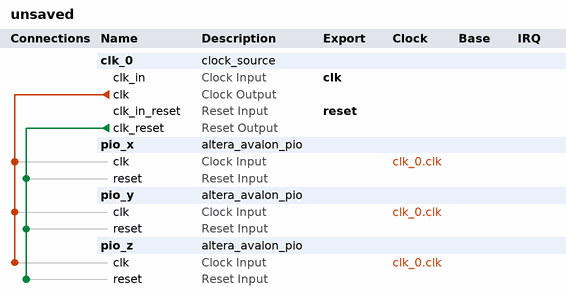
[diagram p0: system contents]
# Platform Designer (Qsys) system unsaved, Cyclone V 5CSEMA5F31C6
# Parameters at their usual value, and those the tool derives, are not listed.
package require -exact qsys 18.1
create_system unsaved
set_project_property DEVICE_FAMILY {Cyclone V}
set_project_property DEVICE 5CSEMA5F31C6

add_instance clk_0 clock_source 18.1
set_instance_parameter_value clk_0 clockFrequency 50000000

add_instance pio_x altera_avalon_pio 18.1
set_instance_parameter_value pio_x direction Input
set_instance_parameter_value pio_x width 32

add_instance pio_y altera_avalon_pio 18.1
set_instance_parameter_value pio_y direction Input
set_instance_parameter_value pio_y width 32

add_instance pio_z altera_avalon_pio 18.1
set_instance_parameter_value pio_z direction Input
set_instance_parameter_value pio_z width 32

# connections
add_connection clk_0.clk pio_x.clk clock
add_connection clk_0.clk pio_y.clk clock
add_connection clk_0.clk pio_z.clk clock
add_connection clk_0.clk_reset pio_x.reset reset
add_connection clk_0.clk_reset pio_y.reset reset
add_connection clk_0.clk_reset pio_z.reset reset

# exported interfaces
add_interface clk clock sink
set_interface_property clk EXPORT_OF clk_0.clk_in
add_interface reset reset sink
set_interface_property reset EXPORT_OF clk_0.clk_in_reset

set_interconnect_requirement {$system} qsys_mm.clockCrossingAdapter HANDSHAKE
set_interconnect_requirement {$system} qsys_mm.enableEccProtection FALSE
set_interconnect_requirement {$system} qsys_mm.insertDefaultSlave FALSE
set_interconnect_requirement {$system} qsys_mm.maxAdditionalLatency 1

save_system unsaved.qsys
